# Altium schematic sheet Tp_Integrador-Lpc845BRK.SchDoc
size A; SheetNumber: 3; SheetTotal: 3
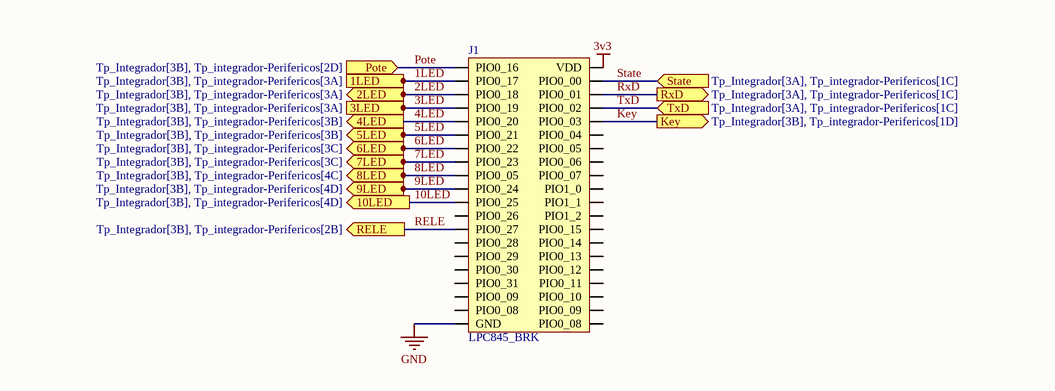
[diagram p0: Tp_Integrador-Lpc845BRK.SchDoc]

## Parts
J1  LPC845_BRK  [LPC845_BRK]

## Ports
1LED (out, see Tp_Integrador[3B], Tp_integrador-Perifericos[3A]), 2LED (out, see Tp_Integrador[3B], Tp_integrador-Perifericos[3A]), 3LED (out, see Tp_Integrador[3B], Tp_integrador-Perifericos[3A]), 4LED (out, see Tp_Integrador[3B], Tp_integrador-Perifericos[3B]), 5LED (out, see Tp_Integrador[3B], Tp_integrador-Perifericos[3B]), 6LED (out, see Tp_Integrador[3B], Tp_integrador-Perifericos[3C]), 7LED (out, see Tp_Integrador[3B], Tp_integrador-Perifericos[3C]), 8LED (out, see Tp_Integrador[3B], Tp_integrador-Perifericos[4C]), 9LED (out, see Tp_Integrador[3B], Tp_integrador-Perifericos[4D]), 10LED (out, see Tp_Integrador[3B], Tp_integrador-Perifericos[4D]), Key (out, see Tp_Integrador[3B], Tp_integrador-Perifericos[1D]), Pote (in, see Tp_Integrador[3B], Tp_integrador-Perifericos[2D]), RELE (out, see Tp_Integrador[3B], Tp_integrador-Perifericos[2B]), RxD (out, see Tp_Integrador[3A], Tp_integrador-Perifericos[1C]), State (in, see Tp_Integrador[3A], Tp_integrador-Perifericos[1C]), TxD (in, see Tp_Integrador[3A], Tp_integrador-Perifericos[1C])

## Nets
3v3: J1.40(VDD)
GND: J1.20(GND)
1LED: J1.2(PIO0_17) ; port 1LED
2LED: J1.3(PIO0_18) ; port 2LED
3LED: J1.4(PIO0_19) ; port 3LED
4LED: J1.5(PIO0_20) ; port 4LED
5LED: J1.6(PIO0_21) ; port 5LED
6LED: J1.7(PIO0_22) ; port 6LED
7LED: J1.8(PIO0_23) ; port 7LED
8LED: J1.9(PIO0_05) ; port 8LED
9LED: J1.10(PIO0_24) ; port 9LED
10LED: J1.11(PIO0_25) ; port 10LED
Key: J1.36(PIO0_03) ; port Key
Pote: J1.1(PIO0_16) ; port Pote
RELE: J1.13(PIO0_27) ; port RELE
RxD: J1.38(PIO0_01) ; port RxD
State: J1.39(PIO0_00) ; port State
TxD: J1.37(PIO0_02) ; port TxD

Not connected (* = marked no-connect by the designer): J1 12(PIO0_26) 14(PIO0_28) 15(PIO0_29) 16(PIO0_30) 17(PIO0_31) 18(PIO0_09) 19(PIO0_08) 21(PIO0_08) 22(PIO0_09) 23(PIO0_10) 24(PIO0_11) 25(PIO0_12) 26(PIO0_13) 27(PIO0_14) 28(PIO0_15) 29(PIO1_2) 30(PIO1_1) 31(PIO1_0) 32(PIO0_07) 33(PIO0_06) 34(PIO0_05) 35(PIO0_04)

## Library data of the parts
J1 = LPC845_BRK: LPC845 breakoutBoard